# Altium schematic sheet Power.SchDoc
size A4; Revision: B.2(PCB.SCH)
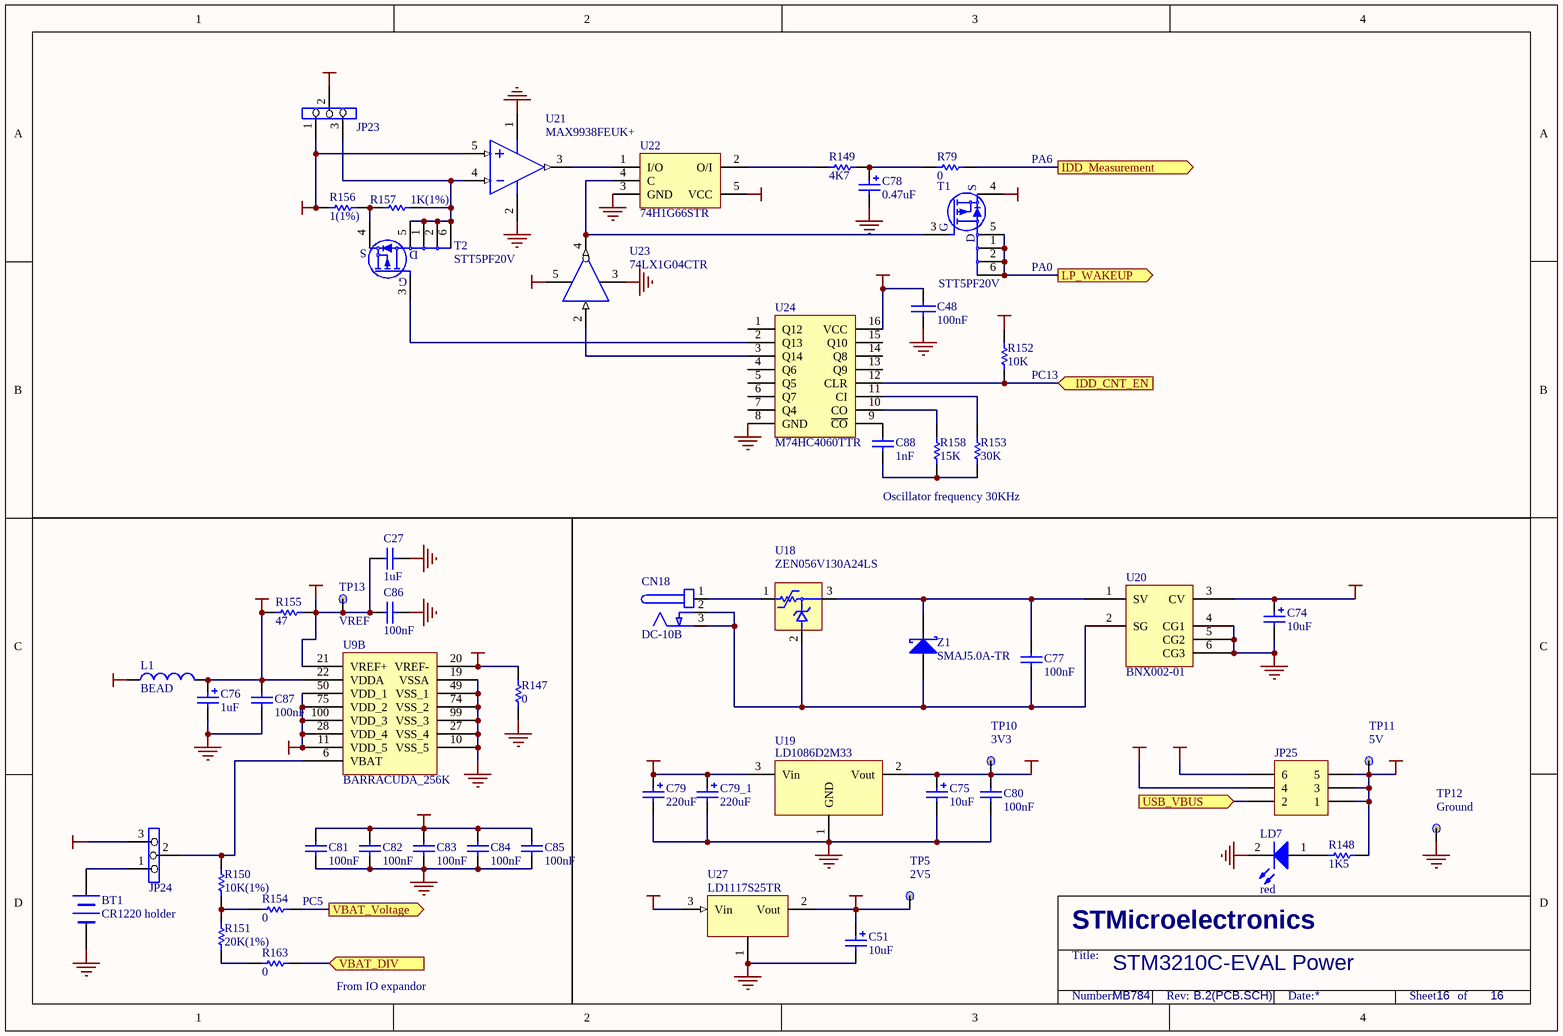
[diagram p0: Power.SchDoc]

## Parts
BT1  CR1220 holder  [LI1220_1]
C27  1uF  [0603C]
C48  100nF  [0603C]
C51  10uF  [TAN-A]
C74  10uF  [C160M]
C75  10uF  [TAN-A]
C76  1uF  [TAN-A]
C77  100nF  [0603C]
C78  0.47uF  [0603C]
C79  220uF  [C310M]
C79_1  220uF  [C310M]
C80  100nF  [0603C]
C81  100nF  [0603C]
C82  100nF  [0603C]
C83  100nF  [0603C]
C84  100nF  [0603C]
C85  100nF  [0603C]
C86  100nF  [0603C]
C87  100nF  [0603C]
C88  1nF  [0603C]
CN18  DC-10B  [DC10B]
JP23  (no value)  [SIP3]
JP24  (no value)  [SIP3]
JP25  (no value)  [2*3P]
L1  BEAD  [0603L]
LD7  red  [0603D]
R79  0  [0603R]
R147  0  [0603R]
R148  1K5  [0603R]
R149  4K7  [0603R]
R150  10K(1%)  [0603R]
R151  20K(1%)  [0603R]
R152  10K  [0603R]
R153  30K  [0603R]
R154  0  [0603R]
R155  47  [0603R]
R156  1(1%)  [0603R]
R157  1K(1%)  [0603R]
R158  15K  [0603R]
R163  0  [0603R]
T1  STT5PF20V  [SOT-23-6L]
T2  STT5PF20V  [SOT-23-6L]
TP5  2V5  [TP]
TP10  3V3  [TP]
TP11  5V  [TP]
TP12  Ground  [TP]
TP13  VREF  [TP]
U9  BARRACUDA_256K  [TQ100_TOOL]  (part B of 2)
U18  ZEN056V130A24LS  [polyzen]
U19  LD1086D2M33  [D2PAK/A]
U20  BNX002-01  [BNX001]
U21  MAX9938FEUK+  [SOT-23-5L]
U22  74H1G66STR  [SOT-23-5L]
U23  74LX1G04CTR  [SOT323-5L]
U24  M74HC4060TTR  [TSSOP16]
U27  LD1117S25TR  [SOT-223]
Z1  SMAJ5.0A-TR  [1R1C]

## Ports
IDD_CNT_EN (in), IDD_Measurement (out), LP_WAKEUP (out), USB_VBUS (in), VBAT_DIV (in), VBAT_Voltage (out)

## Nets
+2V5: C51.1 TP5.1 U27.2(Vout)
+3V3: C48.1 C75.1 C80.1 JP23.1 JP24.3 R152.1 R156.2 T1.4(S) TP10.1 U19.2(Vout) U21.5(Vp) U22.5(VCC) U23.5(VCC) U24.16(VCC)
+5V: C79.1 C79_1.1 JP25.1 JP25.3 JP25.5 R148.2 TP11.1 U19.3(Vin) U27.3(Vin)
D5V: JP25.4
E5V: C74.1 JP25.6 U20.3(CV)
GND: BT1.2(-) C27.2 C48.2 C51.2 C74.2 C75.2 C76.2 C78.2 C79.2 C79_1.2 C80.2 C81.2 C82.2 C83.2 C84.2 C85.2 C86.2 C87.2 LD7.2(K) R147.1 TP12.1 U9.10(VSS_5) U9.19(VSSA) U9.27(VSS_4) U9.49(VSS_1) U9.74(VSS_2) U9.99(VSS_3) U19.1(GND) U20.4(CG1) U20.5(CG2) U20.6(CG3) U21.1(GND) U21.2(GND) U22.3(GND) U23.3(GND) U24.8(GND) U27.1
VDD_MCU: C81.1 C82.1 C83.1 C84.1 C85.1 JP23.2 L1.1 U9.11(VDD_5) U9.28(VDD_4) U9.50(VDD_1) U9.75(VDD_2) U9.100(VDD_3)
VDDA: C76.1 C87.1 L1.2 R155.2 U9.22(VDDA)
VREF+: C27.1 C86.1 R155.1 TP13.1 U9.21(VREF+)
VREF-: R147.2 U9.20(VREF-)
IDD_CNT_EN: R152.2 U24.12(CLR) ; port IDD_CNT_EN
IDD_Measurement: R79.2 ; port IDD_Measurement
LP_WAKEUP: T1.1(D) T1.2(D) T1.5(D) T1.6(D) ; port LP_WAKEUP
USB_VBUS: JP25.2 ; port USB_VBUS
VBAT_DIV: R163.1 ; port VBAT_DIV
VBAT_Voltage: R154.1 ; port VBAT_Voltage
NetBT1_1: BT1.1(+) JP24.1
NetC77_1: C77.1 U18.3 U20.1(SV) Z1.2(K)
NetC77_2: C77.2 CN18.2(GND) CN18.3(GND) U18.2 U20.2(SG) Z1.1(A)
NetC78_1: C78.1 R79.1 R149.2
NetC88_1: C88.1 U24.9(~{CO})
NetC88_2: C88.2 R153.2 R158.2
NetCN18_1: CN18.1(+) U18.1
NetJP23_3: JP23.3 R157.1 T2.1(D) T2.2(D) T2.5(D) T2.6(D) U21.4(Vm)
NetJP24_2: JP24.2 R150.2 U9.6(VBAT)
NetLD7_1: LD7.1(A) R148.1
NetR149_1: R149.1 U22.2(O/I)
NetR150_1: R150.1 R151.2 R154.2
NetR151_1: R151.1 R163.2
NetR153_1: R153.1 U24.11(CI)
NetR156_1: R156.1 R157.2 T2.4(S)
NetR158_1: R158.1 U24.10(CO)
NetT1_3: T1.3(G) U22.4(C) U23.4(1Y)
NetT2_3: T2.3(G) U24.2(Q13)
NetU21_3: U21.3(OUT) U22.1(I/O)
NetU23_2: U23.2(1A) U24.3(Q14)

Not connected (* = marked no-connect by the designer): U23 1(NC); U24 1(Q12) 4(Q6) 5(Q5) 6(Q7) 7(Q4) 13(Q9) 14(Q8) 15(Q10)

## Notes on the sheet
- PA6
- PA0
- (near R152) PC13
- Oscillator frequency 30KHz
- (near R154) PC5
- (near R163) From IO expandor
- STM3210C-EVAL Power
- MB784
- 16
- STMicroelectronics
- Title:
- Number:
- Rev:
- Date:
- Sheet       of

## Library data of the parts
BT1 = BATTERY
C27 C80-C88 = Cap: Capacitor; Value: 10nF; Published: 8-Jun-2000; Revision: July-2002: Re-released for DXP Platform.; Publisher: Altium Limited
C48 = CAP
C51 C75 = Cap Pol1: Polarized Capacitor (Radial); Published: 8-Jun-2000; Revision: July-2002: Re-released for DXP Platform.; Publisher: Altium Limited; Value: 10uF
C74 = Cap Pol1: Polarized Capacitor (Radial); Value: 47uF; Published: 8-Jun-2000; Revision: July-2002: Re-released for DXP Platform.; Publisher: Altium Limited
C76 C78 C79 C79_1 = Cap Pol1: Polarized Capacitor (Radial); Value: 10uF; Published: 8-Jun-2000; Revision: July-2002: Re-released for DXP Platform.; Publisher: Altium Limited
C77 = CAP: Capacitor; Value: 100pF; Published: 8-Jun-2000; Revision: July-2002: Re-released for DXP Platform.; Publisher: Altium Limited
CN18 = PJ202A
JP23 JP24 = Jumper3
JP25 = Header 3X2: Header, 3-Pin, Dual row; Revision: 17-Jul-2002: Re-released for DXP Platform.; Publisher: Altium Limited
L1 = Inductor: Value: 100uH; Published: 8-Jun-2000; Revision: July-2002: Re-released for DXP Platform.; Publisher: Altium Limited
LD7 = LED2: Typical RED, GREEN, YELLOW, AMBER GaAs LED; Published: 8-Jun-2000; Revision: July-2002: Re-released for DXP Platform.; Publisher: Altium Limited
R79 R148-R154 R156 R158 R163 = res1: Resistor; Value: 1K; Published: 8-Jun-2000; Revision: July-2002: Re-released for DXP Platform.; Publisher: Altium Limited
R147 R155 = Res1: Resistor; Value: 1K; Published: 8-Jun-2000; Revision: July-2002: Re-released for DXP Platform.; Publisher: Altium Limited
R157 = res1: Resistor; Published: 8-Jun-2000; Revision: July-2002: Re-released for DXP Platform.; Publisher: Altium Limited; Value: 1K
TP5 TP10-TP13 = TP
U19 = VOLTREG1
U20 = BNX002
U21 = TSC101BILT
U27 = LD1117
Z1 = D Schottky: Schottky Diode; Code - JEDEC: DO-214-AA; Published: 8-Jun-2000; Revision: July-2002: Re-released for DXP Platform.; Publisher: Altium Limited